# EasyEDA schematic SCH_pls work not lose_2022-07-18.json
TITLE: All; REV: 6.0; Date: 2022-06-05; Sheet: 1/1; Drawn By: KNACKSAT2 TGPS ELECTRICAL TEAM; Company: KNACKSAT2 TGPS
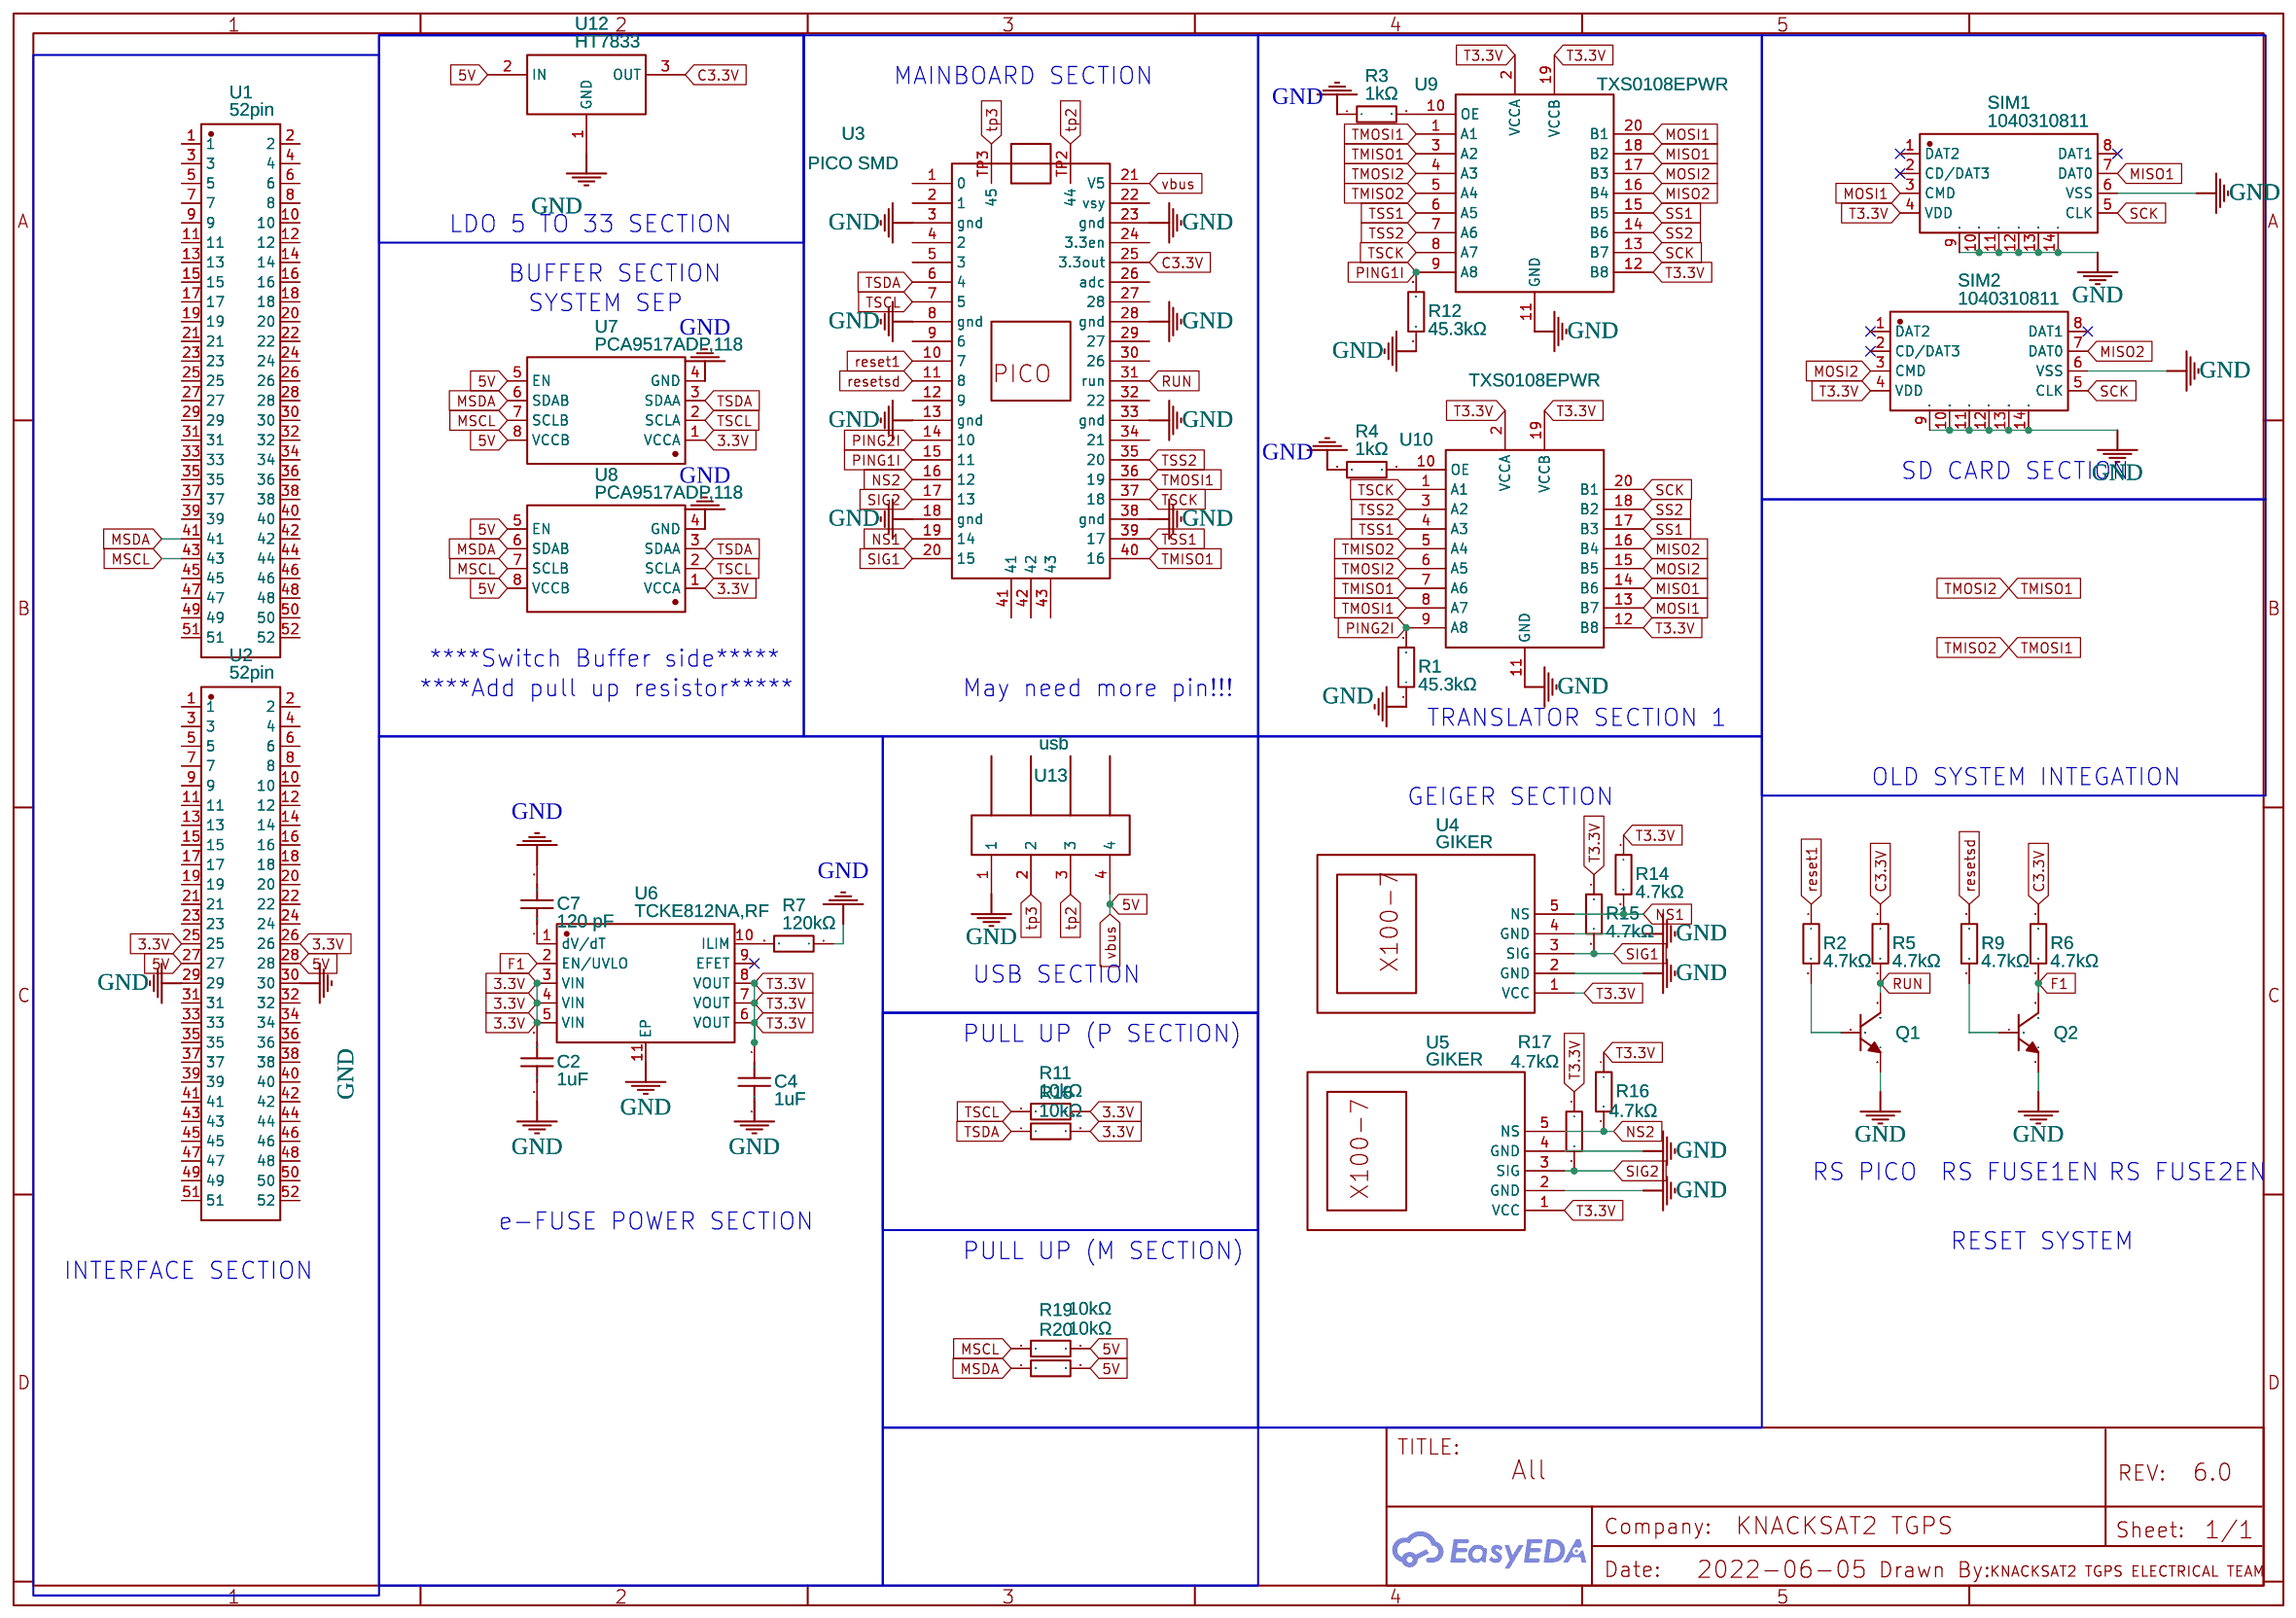
[diagram p0: schematic sheet]

## Parts
C2  1uF  [C0603]
C4  1uF  [C0603]
C7  120 pF  [C0603]
Q1  2SC3324-BL(TE85L,F  [TO-236MOD_L2.9-W1.5-P0.95-LS2.5-BR]
Q2  2SC3324-BL(TE85L,F  [TO-236MOD_L2.9-W1.5-P0.95-LS2.5-BR]
R1  45.3kΩ  [R0402]
R2  4.7kΩ  [R0805]
R3  1kΩ  [R0805]
R4  1kΩ  [R0805]
R5  4.7kΩ  [R0805]
R6  4.7kΩ  [R0805]
R7  120kΩ  [R0402]
R9  4.7kΩ  [R0805]
R11  10kΩ  [R0805]
R12  45.3kΩ  [R0402]
R14  4.7kΩ  [R0805]
R15  4.7kΩ  [R0805]
R16  4.7kΩ  [R0805]
R17  4.7kΩ  [R0805]
R18  10kΩ  [R0805]
R19  10kΩ  [R0805]
R20  10kΩ  [R0805]
SIM1  1040310811  [SIM-SMD_8P-1040310811]
SIM2  1040310811  [SIM-SMD_8P-1040310811]
U1  52pin  [52PIN]
U2  52pin  [52PIN]
U3  PICO SMD  [PICO SMD]
U4  GIKER  [GIKER]
U5  GIKER  [GIKER]
U6  TCKE812NA,RF  [VSON-10_L3.0-W3.0-P0.50-TL-EP]
U7  PCA9517ADP,118  [TSSOP-8_L3.0-W3.0-P0.65-LS4.9-BL]
U8  PCA9517ADP,118  [TSSOP-8_L3.0-W3.0-P0.65-LS4.9-BL]
U9  TXS0108EPWR  [TSSOP-20_L6.5-W4.4-P0.65-LS6.4-BL]
U10  TXS0108EPWR  [TSSOP-20_L6.5-W4.4-P0.65-LS6.4-BL]
U12  HT7833  [SOT-89_L4.5-W2.5-P1.50-LS4.2-BR]
U13  usb  [USB]

## Library data of the parts
C2 C4 C7 = C_0603_US: Contributor: LCEDA_Lib
Q1 Q2 = 2SC3324-BL(TE85L,F: Supplier: LCSC; Supplier Part: C2999171; Manufacturer: TOSHIBA(东芝); link: https://atta.szlcsc.com/upload/public/pdf/source/20220419/9CBA271483DAD6BD386FD99D0ED7F900.pdf; Contributor: lcsc; JLCPCB Part Class: Extended Part
R1 R12 = RMC040245.3K1%N: Supplier: LCSC; Supplier Part: C325554; Manufacturer: Tyohm; Resistance (Ohms): 45.3K; Contributor: LCSC; JLCPCB Part Class: Extended Part
R2 R5 R6 R9 R14-R17 = RMC08054.7K1%N: Supplier: LCSC; Supplier Part: C269746; Manufacturer: Tyohm; Resistance (Ohms): 4.7K; Contributor: LCSC; JLCPCB Part Class: Extended Part
R3 R4 = PTFR0805B1K00N9: Supplier: LCSC; Supplier Part: C328437; Manufacturer: ResistorToday; Resistance (Ohms): 1K; Contributor: LCSC; JLCPCB Part Class: Extended Part
R7 = RMC0402120K1%N: Supplier: LCSC; Supplier Part: C325558; Manufacturer: Tyohm; Resistance (Ohms): 120K; Contributor: LCSC; JLCPCB Part Class: Extended Part
R11 R18-R20 = AECR0805F10K0K9: Supplier: LCSC; Supplier Part: C328381; Manufacturer: ResistorToday; Resistance (Ohms): 10K; Contributor: LCSC; JLCPCB Part Class: Extended Part
SIM1 SIM2 = 1040310811: Supplier: LCSC; Supplier Part: C585350; Manufacturer: MOLEX; Contributor: LCSC; JLCPCB Part Class: Extended Part
U1 U2 = 52pin: Contributor: gundambright
U3 = PICO SMD
U4 U5 = GIKER: Contributor: gundambright
U6 = TCKE812NA,RF: Supplier: LCSC; Supplier Part: C1880271; Manufacturer: TOSHIBA(东芝); link: https://atta.szlcsc.com/upload/public/pdf/source/20210624/C1880271_1DB4238C84822E0FB18952F77CFF5FA0.pdf; Contributor: lcsc
U7 U8 = PCA9517ADP,118: Supplier: LCSC; Manufacturer: NXP; Supplier Part: C80799; JLCPCB Part Class: Extended Part
U9 U10 = TXS0108EPWR: Supplier: LCSC; Manufacturer: TI; Supplier Part: C17206; JLCPCB Part Class: Extended Part
U12 = HT7833: Supplier: LCSC; Manufacturer: HOLTEK; Supplier Part: C50936; JLCPCB Part Class: Extended Part
U13 = usb: Contributor: pongsan.wong

## Nets
3.3V: C2.2 R11.2 R18.2 U2.25 U2.26 U6.3(VIN) U6.4(VIN) U6.5(VIN) U7.1(VCCA) U8.1(VCCA)
5V: R19.2 R20.2 U2.27 U2.28 U3.21(V5) U7.5(EN) U7.8(VCCB) U8.5(EN) U8.8(VCCB) U12.2(IN) U13.4
GND: C2.1 C4.1 C7.2 Q1.2(E) Q2.2(E) R1.1 R3.1 R4.1 R7.1 R12.1 SIM1.6(VSS) SIM1.9 SIM1.10 SIM1.11 SIM1.12 SIM1.13 SIM1.14 SIM2.6(VSS) SIM2.9 SIM2.10 SIM2.11 SIM2.12 SIM2.13 SIM2.14 U2.29 U2.30 U3.3(gnd) U3.8(gnd) U3.13(gnd) U3.18(gnd) U3.23(gnd) U3.28(gnd) U3.33(gnd) U3.38(gnd) U4.2(GND) U4.4(GND) U5.2(GND) U5.4(GND) U6.11(EP) U7.4(GND) U8.4(GND) U9.11(GND) U10.11(GND) U12.1(GND) U13.1
C3.3V: R5.1 R6.1 U3.25(3.3out) U12.3(OUT)
F1: Q2.3(C) R6.2 U6.2(EN/UVLO)
MISO1: SIM1.7(DAT0) U9.18(B2) U10.14(B6)
MISO2: SIM2.7(DAT0) U9.16(B4) U10.16(B4)
MOSI1: SIM1.3(CMD) U9.20(B1) U10.13(B7)
MOSI2: SIM2.3(CMD) U9.17(B3) U10.15(B5)
MSCL: R19.1 U1.43 U7.7(SCLB) U8.7(SCLB)
MSDA: R20.1 U1.41 U7.6(SDAB) U8.6(SDAB)
NS1: R14.2 U3.19(14) U4.5(NS)
NS2: R16.2 U3.16(12) U5.5(NS)
PING1I: R12.2 U3.15(11) U9.9(A8)
PING2I: R1.2 U3.14(10) U10.9(A8)
reset1: R2.1 U3.10(7)
resetsd: R9.1 U3.11(8)
RUN: Q1.3(C) R5.2 U3.31(run)
SCK: SIM1.5(CLK) SIM2.5(CLK) U9.13(B7) U10.20(B1)
SIG1: R15.2 U3.20(15) U4.3(SIG)
SIG2: R17.2 U3.17(13) U5.3(SIG)
SS1: U9.15(B5) U10.17(B3)
SS2: U9.14(B6) U10.18(B2)
T3.3V: C4.2 R14.1 R15.1 R16.1 R17.1 SIM1.4(VDD) SIM2.4(VDD) U4.1(VCC) U5.1(VCC) U6.6(VOUT) U6.7(VOUT) U6.8(VOUT) U9.2(VCCA) U9.12(B8) U9.19(VCCB) U10.2(VCCA) U10.12(B8) U10.19(VCCB)
TMISO1: U3.40(16) U9.3(A2) U9.4(A3) U10.6(A5) U10.7(A6)
TMISO2: U3.36(19) U9.1(A1) U9.5(A4) U10.5(A4) U10.8(A7)
tp2: U3.TP2(44) U13.3
tp3: U3.TP3(45) U13.2
TSCK: U3.37(18) U9.8(A7) U10.1(A1)
TSCL: R11.1 U3.7(5) U7.2(SCLA) U8.2(SCLA)
TSDA: R18.1 U3.6(4) U7.3(SDAA) U8.3(SDAA)
TSS1: U3.39(17) U9.6(A5) U10.4(A3)
TSS2: U3.35(20) U9.7(A6) U10.3(A2)
Net-(C7-1): C7.1 U6.1(dV/dT)
Net-(Q1-1): Q1.1(B) R2.2
Net-(Q2-1): Q2.1(B) R9.2
Net-(R3-2): R3.2 U9.10(OE)
Net-(R4-2): R4.2 U10.10(OE)
Net-(R7-2): R7.2 U6.10(ILIM)

Not connected (* = marked no-connect by the designer): SIM1 1(DAT2)* 2(CD/DAT3)* 8(DAT1)*; SIM2 1(DAT2)* 2(CD/DAT3)* 8(DAT1)*; U1 1 2 3 4 5 6 7 8 9 10 11 12 13 14 15 16 17 18 19 20 21 22 23 24 25 26 27 28 29 30 31 32 33 34 35 36 37 38 39 40 42 44 45 46 47 48 49 50 51 52; U2 1 2 3 4 5 6 7 8 9 10 11 12 13 14 15 16 17 18 19 20 21 22 23 24 31 32 33 34 35 36 37 38 39 40 41 42 43 44 45 46 47 48 49 50 51 52; U3 1(0) 2(1) 4(2) 5(3) 9(6) 12(9) 22(vsy) 24(3.3en) 26(adc) 27(28) 29(27) 30(26) 32(22) 34(21) 41 42 43; U6 9(EFET)*

## Notes on the sheet
- MAINBOARD SECTION
- LDO 5 TO 33 SECTION
- BUFFER SECTION
- SYSTEM SEP
- SD CARD SECTION
- ****Switch Buffer side*****
- ****Add pull up resistor*****
- May need more pin!!!
- TRANSLATOR SECTION 1
- OLD SYSTEM INTEGATION
- GEIGER SECTION
- USB SECTION
- PULL UP (P SECTION)
- RS PICO
- RS FUSE1EN
- RS FUSE2EN
- e-FUSE POWER SECTION
- RESET SYSTEM
- INTERFACE SECTION
- PULL UP (M SECTION)
